# Altium schematic sheet MCU.SchDoc
size A2; Organization: Altium Limited; Address1: L3, 12a Rodborough Rd; Address2: Frenchs Forest; Address3: NSW; Address4: Australia 2086
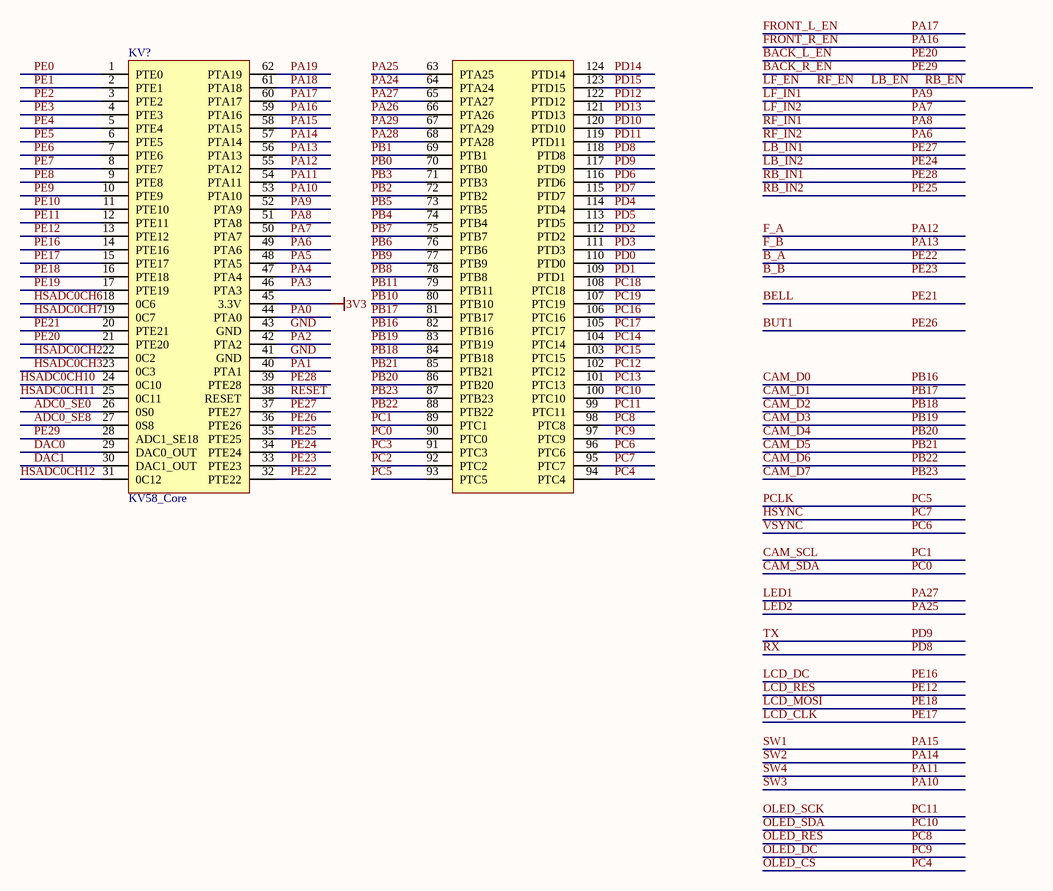
[diagram p0: MCU.SchDoc]

## Parts
KV?  KV58_Core  [KV58_Core_LQ]

## Nets
3V3: KV?.45(3.3V)
ADC0_SE0: KV?.26(0S0)
ADC0_SE8: KV?.27(0S8)
B_A: KV?.32(PTE22)  [also labelled PE22]
B_B: KV?.33(PTE23)  [also labelled PE23]
BACK_L_EN: KV?.21(PTE20)  [also labelled PE20]
BACK_R_EN: KV?.28(ADC1_SE18)  [also labelled PE29]
BELL: KV?.20(PTE21)  [also labelled PE21]
BUT1: KV?.36(PTE26)  [also labelled PE26]
CAM_D0: KV?.82(PTB16)  [also labelled PB16]
CAM_D1: KV?.81(PTB17)  [also labelled PB17]
CAM_D2: KV?.84(PTB18)  [also labelled PB18]
CAM_D3: KV?.83(PTB19)  [also labelled PB19]
CAM_D4: KV?.86(PTB20)  [also labelled PB20]
CAM_D5: KV?.85(PTB21)  [also labelled PB21]
CAM_D6: KV?.88(PTB22)  [also labelled PB22]
CAM_D7: KV?.87(PTB23)  [also labelled PB23]
CAM_SCL: KV?.89(PTC1)  [also labelled PC1]
CAM_SDA: KV?.90(PTC0)  [also labelled PC0]
DAC0: KV?.29(DAC0_OUT)
DAC1: KV?.30(DAC1_OUT)
F_A: KV?.55(PTA12)  [also labelled PA12]
F_B: KV?.56(PTA13)  [also labelled PA13]
FRONT_L_EN: KV?.60(PTA17)  [also labelled PA17]
FRONT_R_EN: KV?.59(PTA16)  [also labelled PA16]
GND: KV?.41(GND) KV?.43(GND)
HSADC0CH2: KV?.22(0C2)
HSADC0CH3: KV?.23(0C3)
HSADC0CH6: KV?.18(0C6)
HSADC0CH7: KV?.19(0C7)
HSADC0CH10: KV?.24(0C10)
HSADC0CH11: KV?.25(0C11)
HSADC0CH12: KV?.31(0C12)
HSYNC: KV?.95(PTC7)  [also labelled PC7]
LB_IN1: KV?.37(PTE27)  [also labelled PE27]
LB_IN2: KV?.34(PTE24)  [also labelled PE24]
LCD_CLK: KV?.15(PTE17)  [also labelled PE17]
LCD_DC: KV?.14(PTE16)  [also labelled PE16]
LCD_MOSI: KV?.16(PTE18)  [also labelled PE18]
LCD_RES: KV?.13(PTE12)  [also labelled PE12]
LED1: KV?.65(PTA27)  [also labelled PA27]
LED2: KV?.63(PTA25)  [also labelled PA25]
LF_IN1: KV?.52(PTA9)  [also labelled PA9]
LF_IN2: KV?.50(PTA7)  [also labelled PA7]
OLED_CS: KV?.94(PTC4)  [also labelled PC4]
OLED_DC: KV?.97(PTC9)  [also labelled PC9]
OLED_RES: KV?.98(PTC8)  [also labelled PC8]
OLED_SCK: KV?.99(PTC11)  [also labelled PC11]
OLED_SDA: KV?.100(PTC10)  [also labelled PC10]
PA0: KV?.44(PTA0)
PA1: KV?.40(PTA1)
PA2: KV?.42(PTA2)
PA3: KV?.46(PTA3)
PA4: KV?.47(PTA4)
PA5: KV?.48(PTA5)
PA6: KV?.49(PTA6)  [also labelled RF_IN2]
PA8: KV?.51(PTA8)  [also labelled RF_IN1]
PA10: KV?.53(PTA10)  [also labelled SW3]
PA11: KV?.54(PTA11)  [also labelled SW4]
PA14: KV?.57(PTA14)  [also labelled SW2]
PA15: KV?.58(PTA15)  [also labelled SW1]
PA18: KV?.61(PTA18)
PA19: KV?.62(PTA19)
PA24: KV?.64(PTA24)
PA26: KV?.66(PTA26)
PA28: KV?.68(PTA28)
PA29: KV?.67(PTA29)
PB0: KV?.70(PTB0)
PB1: KV?.69(PTB1)
PB2: KV?.72(PTB2)
PB3: KV?.71(PTB3)
PB4: KV?.74(PTB4)
PB5: KV?.73(PTB5)
PB6: KV?.76(PTB6)
PB7: KV?.75(PTB7)
PB8: KV?.78(PTB8)
PB9: KV?.77(PTB9)
PB10: KV?.80(PTB10)
PB11: KV?.79(PTB11)
PC2: KV?.92(PTC2)
PC3: KV?.91(PTC3)
PC5: KV?.93(PTC5)  [also labelled PCLK]
PC6: KV?.96(PTC6)  [also labelled VSYNC]
PC12: KV?.102(PTC12)
PC13: KV?.101(PTC13)
PC14: KV?.104(PTC14)
PC15: KV?.103(PTC15)
PC16: KV?.106(PTC16)
PC17: KV?.105(PTC17)
PC18: KV?.108(PTC18)
PC19: KV?.107(PTC19)
PD0: KV?.110(PTD0)
PD1: KV?.109(PTD1)
PD2: KV?.112(PTD2)
PD3: KV?.111(PTD3)
PD4: KV?.114(PTD4)
PD5: KV?.113(PTD5)
PD6: KV?.116(PTD6)
PD7: KV?.115(PTD7)
PD8: KV?.118(PTD8)  [also labelled RX]
PD9: KV?.117(PTD9)  [also labelled TX]
PD10: KV?.120(PTD10)
PD11: KV?.119(PTD11)
PD12: KV?.122(PTD12)
PD13: KV?.121(PTD13)
PD14: KV?.124(PTD14)
PD15: KV?.123(PTD15)
PE0: KV?.1(PTE0)
PE1: KV?.2(PTE1)
PE2: KV?.3(PTE2)
PE3: KV?.4(PTE3)
PE4: KV?.5(PTE4)
PE5: KV?.6(PTE5)
PE6: KV?.7(PTE6)
PE7: KV?.8(PTE7)
PE8: KV?.9(PTE8)
PE9: KV?.10(PTE9)
PE10: KV?.11(PTE10)
PE11: KV?.12(PTE11)
PE19: KV?.17(PTE19)
PE25: KV?.35(PTE25)  [also labelled RB_IN2]
PE28: KV?.39(PTE28)  [also labelled RB_IN1]
RESET: KV?.38(RESET)

## Notes on the sheet
- Title
- Size:
- Date:
- File:
- A2
- Number:
- Time:
- Revision:
- Sheet
- of

## Library data of the parts
KV? = LQ_KV58P144-SYSVG